# EasyEDA Pro project EasyEDApro.epro, board EnergyMeter
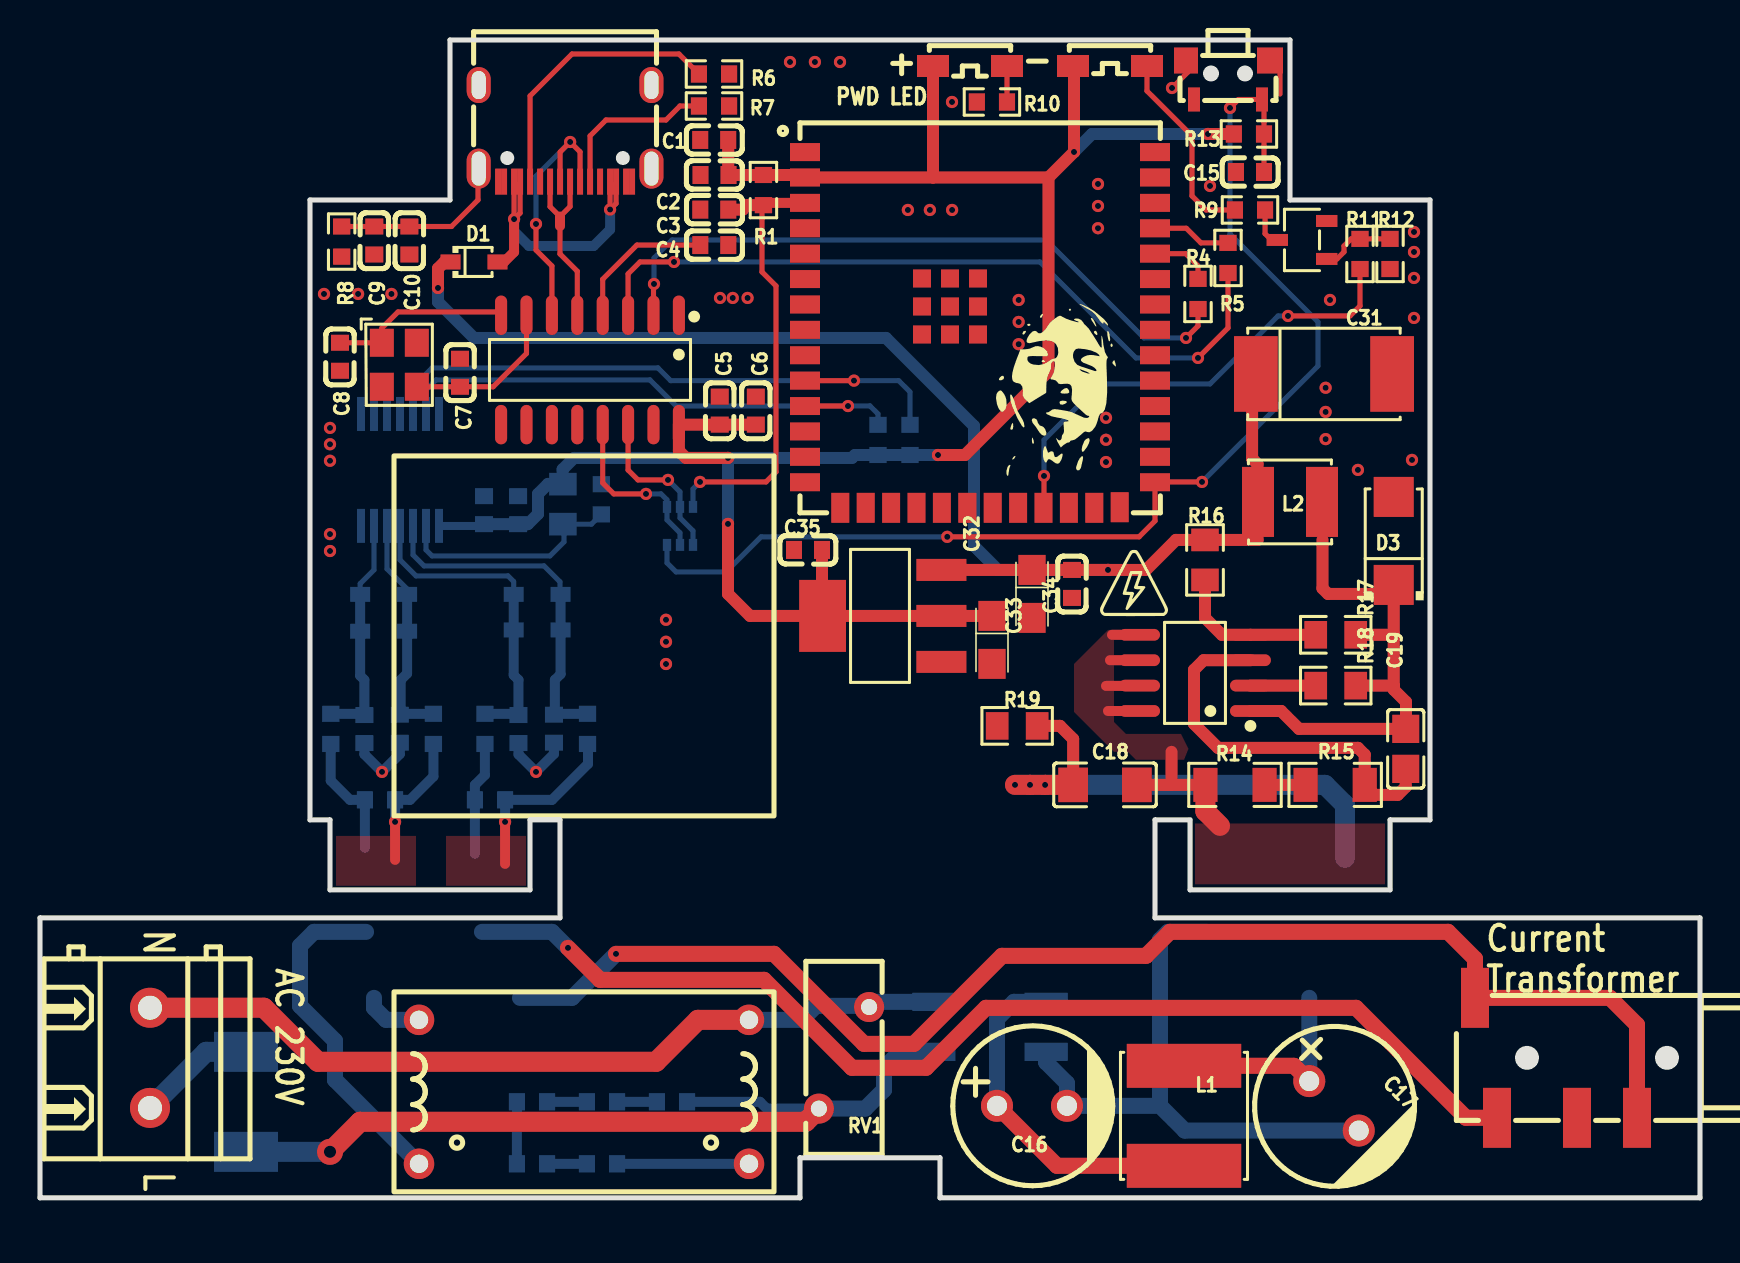
[diagram p1: board, top side]
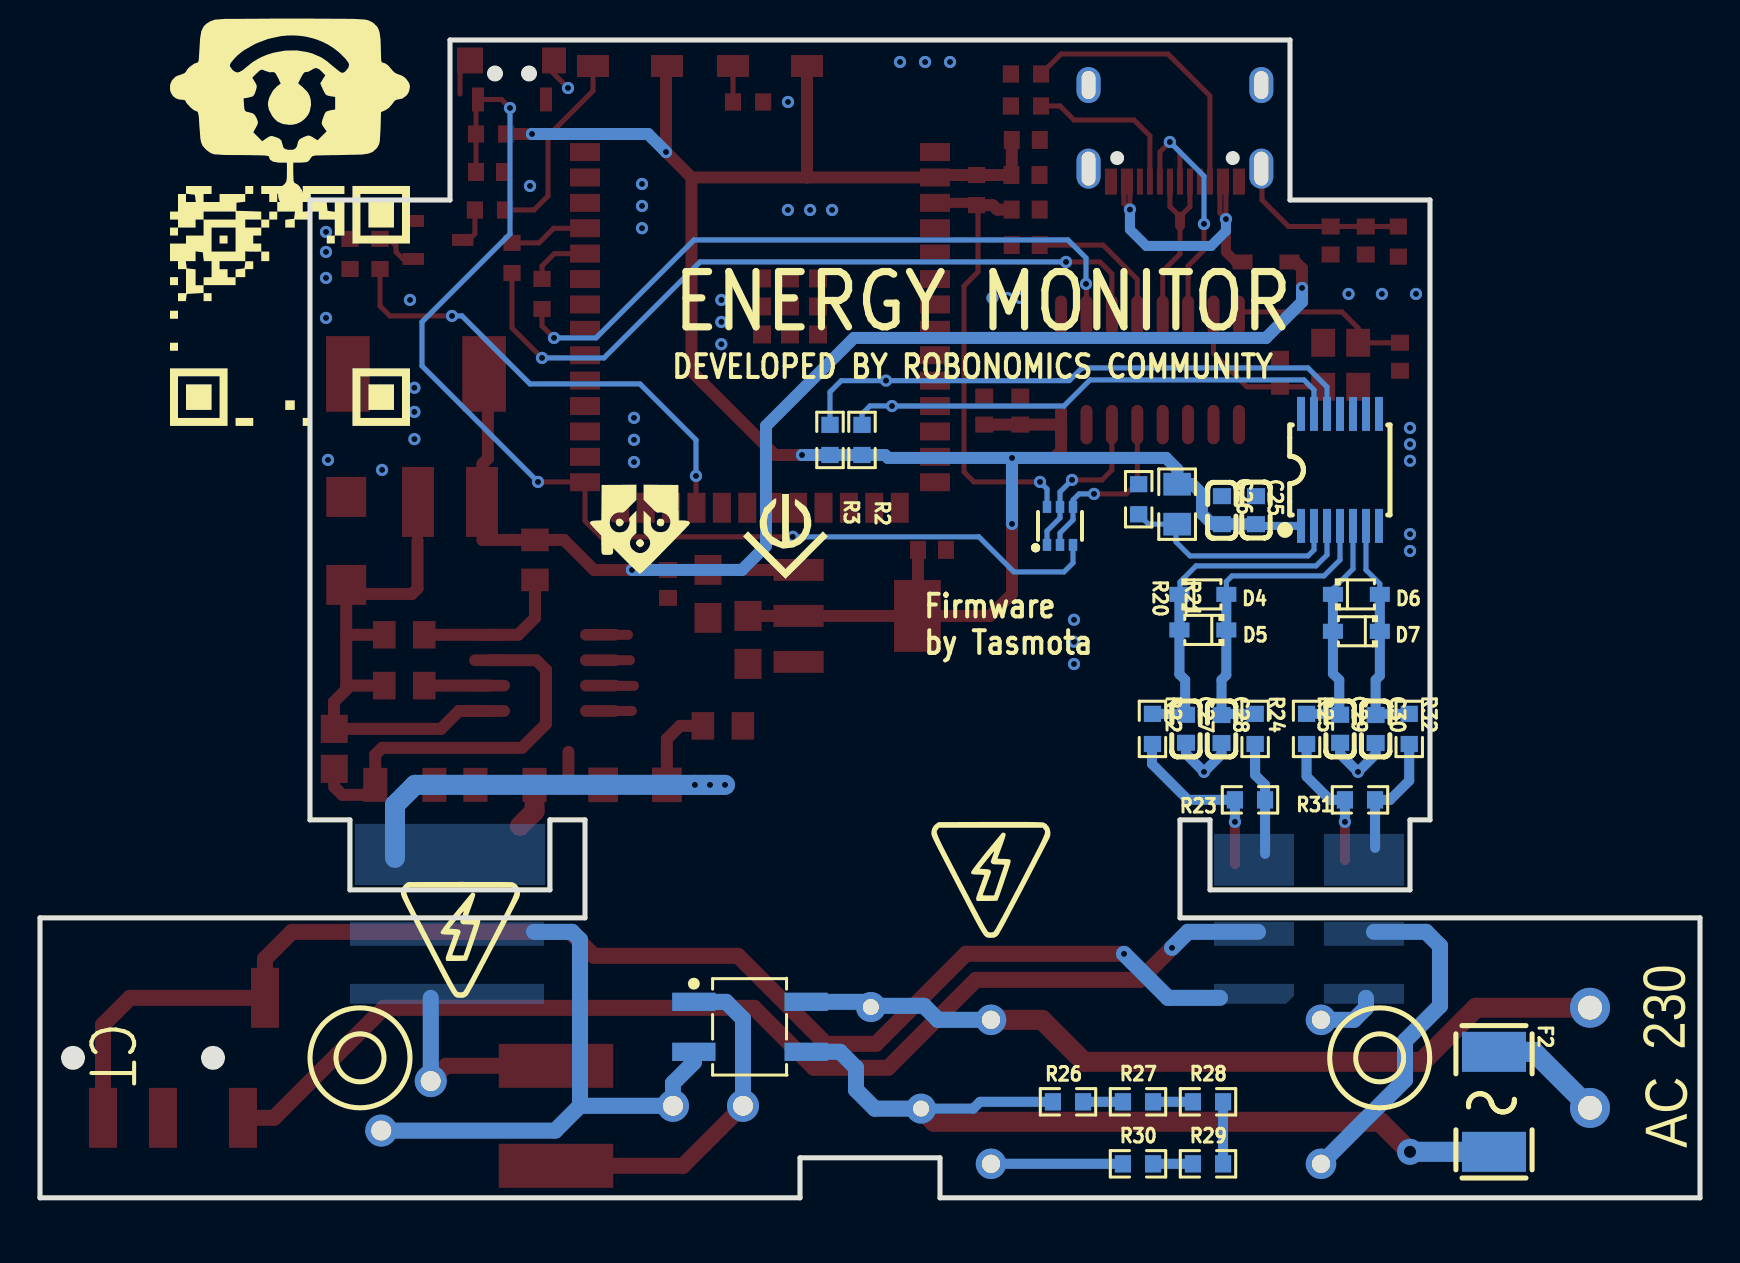
[diagram p2: board, bottom side, seen from below]

Outline 83 x 57.9 mm; copper layers: Top Layer, Bottom Layer. Coordinates in mm from the lower left corner of the outline.
Outline path: 0,14 26,14 26,18.9 24.5,18.9 24.5,15.4 14.5,15.4 14.5,18.9 13.5,18.9 13.5,49.9 20.5,49.9 20.5,57.9 62.5,57.9 62.5,49.9 69.5,49.9 69.5,18.9 67.5,18.9 67.5,15.4 57.5,15.4 57.5,18.9 55.75,18.9 55.75,14 83,14 83,0 45,0 45,2 38,2 38,0 0,0 0,14
Stack: Top Layer 0.035mm / Dielectric1 1.51mm FR4 er 4.5 / Bottom Layer 0.035mm

## Design rules (mm)
template: JLCPCB Capability(Two Layers Board)
spacing copperThickness1oz (default): track to track 0.102, other pairs 0.152 to 0.3
spacing copperThickness2oz: track to track 0.203, other pairs 0.152 to 0.3
track width copperThickness1oz (default): min 0.127, default 0.254, max 2.54
track width copperThickness2oz: min 0.203, default 0.254, max 2.54
differential pair differentialPair (default): width min 0.127, default 0.254, max 2.54; gap min 0.152, default 0.152
via viaSize (default): diameter min 0.5, default 0.61, max 10; hole min 0.3, default 0.305, max 6.3

## Placement (name value [footprint] x y rotation side)
C1  100nF  [C0603]  33.71 52.9 180 top
C2  10uF  [c0603]  33.73 51.15 0 top
C3  100nF  [C0603]  33.72 49.42 180 top
C4  100nF  [C0603]  33.72 47.65 180 top
C5  100nF  [C0603]  33.99 39.36 90 top
C6  10nF  [C0603]  35.79 39.36 90 top
C7  22pF  [C0603]  21 41.26 270 top
C8  22pF  [C0603]  15 42.06 90 top
C9  100nF  [C0603]  16.72 47.87 90 top
C10  1nF  [C0603]  18.47 47.87 90 top
C15  100nF  [C0603]  60.5 51.3 180 top
C16  3.3uF  [CAP-TH_BD8.0-P3.50-D0.6-FD]  49.6 4.6 0 top
C17  3.3uF  [CAP-TH_BD8.0-P3.50-D0.6-FD]  64.7 4.6 315 top
C18  10nF  [C1206]  53.25 20.65 0 top
C19  2.2uF  [C0805]  68.29 22.45 270 top
C25  10uF  [C0603]  22.2 34.39 270 bottom
C26  100nF  [C0603]  23.9 34.39 90 bottom
C27  33nF  [C0603]  25.7 23.46 90 bottom
C28  33nF  [C0603]  23.92 23.44 270 bottom
C29  33nF  [C0603]  17.99 23.46 90 bottom
C30  33nF  [C0603]  16.22 23.44 270 bottom
C31  680uF  [CAP-SMD_L7.3-W4.3]  64.2 41.2 180 top
C32  22uF  [CASE-A_3216]  47.6 27.9 270 top
C33  22uF  [CASE-A_3216]  49.6 30.2 270 top
C34  100nF  [C0603]  51.6 30.7 90 top
C35  100nF  [C0603]  38.4 32.4 0 top
CN1  PJ-320D  [AUDIO-SMD_PJ-320D]  75.8 7 270 top
D1  -  [SOD-323_L1.8-W1.3-LS2.5-RD]  21.7 46.8 0 top
D2  MB10F  [MBF_L4.8-W3.9-P2.50-LS6.7-BL]  47.5 8.55 270 bottom
D3  ES1J  [SMA_L4.3-W2.6-LS5.2-RD]  67.69 32.85 90 top
D4  1N4148WS  [SOD-323_L1.8-W1.3-LS2.5-RD]  24.86 30.18 180 bottom
D5  1N4148WS  [SOD-323_L1.8-W1.3-LS2.5-RD]  24.86 28.4 0 bottom
D6  1N4148WS  [SOD-323_L1.8-W1.3-LS2.5-RD]  17.18 30.18 180 bottom
D7  1N4148WS  [SOD-323_L1.8-W1.3-LS2.5-RD]  17.18 28.33 0 bottom
F2  JFC2410-1200FS  [F2410]  10.3 4.8 270 bottom
L1  680uH  [IND-SMD_L6.0-W6.0]  57.2 4.1 90 top
L2  470uH  [IND-SMD_L4.0-W4.0]  62.5 34.8 180 top
L3  HPT225A-G  [XFMR-TH_4P-L19.0-10.0-P7.20]  27.2 5.3 180 top
LED2  XL-4008UGC  [LED-SMD_L4.0-W1.4-RD_GREEN]  53.5 56.6 180 top
P1  WJ128V-5.0-2P  [CONN-TH_2P-P5.00_WJ128V-5.0-2P]  5.5 7 270 top
Q1  -  [SC-70-6_L2.2-W1.3-P0.65-LS2.1-BR]  32 33.6 270 bottom
Q2  SS8050  [SOT-23-3_L2.9-W1.6-P1.90-LS2.8-BR]  63.1 47.9 0 top
R1  10kΩ  [R0603]  36.17 50.4 270 top
R2  4.7kΩ  [R0603]  41.9 37.9 90 bottom
R3  4.7kΩ  [R0603]  43.5 37.9 90 bottom
R4  470  [R0603]  57.9 45.2 270 top
R5  470  [R0603]  59.4 47 270 top
R6  5.1kΩ  [R0603]  33.7 56.2 180 top
R7  5.1kΩ  [R0603]  33.7 54.6 180 top
R8  1MΩ  [R0603]  15.08 47.82 90 top
R9  1kΩ  [R0603]  60.5 49.4 180 top
R10  1kΩ  [R0603]  47.6 54.8 0 top
R11  1kΩ  [R0603]  66 47.2 90 top
R12  10kΩ  [R0603]  67.5 47.2 270 top
R13  10kΩ  [R0603]  60.45 53.2 0 top
R14  1.5MΩ  [R1206]  59.75 20.65 0 top
R15  1.5MΩ  [R1206]  64.76 20.65 0 top
R16  36kΩ  [R0805]  58.25 31.9 270 top
R17  10kΩ  [R0805]  64.79 28.16 180 top
R18  820mΩ  [R0805]  64.79 25.62 180 top
R19  0Ω  [R0805]  48.86 23.6 0 top
R20  10kΩ  [R0603]  28.07 34.93 90 bottom
R21  SDNT2012X103F3950FTF  [R0805]  26.14 34.69 90 bottom
R22  1kΩ  [R0603]  27.38 23.45 90 bottom
R23  1Ω  [R0603]  22.5 19.9 0 bottom
R24  1kΩ  [R0603]  22.24 23.45 90 bottom
R25  1kΩ  [R0603]  19.67 23.45 90 bottom
R26  20kΩ  [R0603]  31.6 4.8 180 bottom
R27  20kΩ  [R0603]  28.1 4.8 180 bottom
R28  20kΩ  [R0603]  24.6 4.8 180 bottom
R29  20kΩ  [R0603]  24.6 1.7 0 bottom
R30  20kΩ  [R0603]  28.1 1.7 0 bottom
R31  22Ω  [R0603]  17 19.9 0 bottom
R32  1kΩ  [R0603]  14.54 23.45 90 bottom
RV1  RM07D471KC14E100  [RES-TH_L9.5-W3.8-P5.08-D0.6-S2.5]  40.2 7 270 top
SW2  TS-1010-C-A  [key-smd_tx-1010-x-x]  59.4 55.9 0 top
U1  ESP32-S3-WROOM-1U-N16  [wirelm-smd_esp32-s3-wroom-1u]  47 43.4 0 top
U4  -  [SOIC-16_L9.9-W3.9-P1.27-LS6.0-BL]  27.5 41.4 180 top
U7  SY50282FAC  [SOIC-8_L4.9-W3.9-P1.27-LS6.0-BL]  57.75 26.25 90 top
U9  BL0940  [TSSOP-14_L5.0-W4.4-P0.65-LS6.4-BL]  18 36.4 180 bottom
U10  XL-4008SURC  [LED-SMD_L4.0-W1.4-FD_C9900036310]  46.5 56.6 0 top
U11  AMS1117-3.3  [SOT-223-3_L6.5-W3.4-P2.30-LS7.0-BR]  42.1 29.1 0 top
USB1  KH-TYPE-C-16P  [USB-C-SMD_KH-TYPE-C-16P]  26.25 53.23 180 top
X1  12MHz  [OSC-SMD_4P-L3.2-W2.5-BL]  17.97 41.66 270 top

## Footprints (pads in the part's own frame, mm; a bottom-side part is the same pattern mirrored in y, then rotated)
AUDIO-SMD_PJ-320D
  rect 3x1.4 smd: 1(-3,-4.05) 2(3,4.05) 3(3,1.05) 4(3,-2.95)
C0603
  rect 0.8x0.9 smd: 1(-0.7,0) 2(0.7,0)
c0603
  rect 0.8x0.899 smd: 1(-0.701,0) 2(0.701,0)
C0805
  rect 1.41x1.35 smd: 1(-1,0) 2(1,0)
C1206
  rect 1.485x1.728 smd: 1(-1.593,0) 2(1.593,0)
CAP-SMD_L7.3-W4.3
  rect 2.185x3.78 smd: 1(3.406,0) 2(-3.406,0)
CAP-TH_BD8.0-P3.50-D0.6-FD
  round 1.6 hole 1: 1(-1.75,0) 2(1.75,0)
CASE-A_3216
  rect 1.5x1.359 smd: 1(-1.2,0) 2(1.2,0)
CONN-TH_2P-P5.00_WJ128V-5.0-2P
  round 2 hole 1.2: 1(-2.505,0) 2(2.505,0)
F2410
  rect 2x3.2 smd: 1(-2.5,0) 2(2.5,0)
IND-SMD_L4.0-W4.0
  rect 1.6x3.5 smd: 1(-1.6,0) 2(1.6,0)
IND-SMD_L6.0-W6.0
  rect 2.2x5.72 smd: 1(-2.5,0) 2(2.5,0)
key-smd_tx-1010-x-x
  rect 0.6x1.2 smd: 1(-1.7,-0.975) 2(1.7,-0.975)
  rect 1.2x1.3 smd: 3(-2.1,0.975)
  rect 1.3x1.3 smd: 4(2.1,0.975)
LED-SMD_L4.0-W1.4-FD_C9900036310
  rect 1.6x1.1 smd: 1(-1.85,0) 2(1.85,0)
LED-SMD_L4.0-W1.4-RD_GREEN
  rect 1.6x1.1 smd: 1(-1.85,0) 2(1.85,0)
MBF_L4.8-W3.9-P2.50-LS6.7-BL
  rect 0.91x2.165 smd: 1(1.25,2.808) 2(-1.25,2.808) 3(-1.25,-2.808) 4(1.25,-2.808)
OSC-SMD_4P-L3.2-W2.5-BL
  rect 1.4x1.2 smd: 1(-1.1,-0.875) 2(1.1,-0.875) 3(1.1,0.875) 4(-1.1,0.875)
R0603
  rect 0.806x0.864 smd: 1(-0.753,0) 2(0.753,0)
R0805
  rect 1.133x1.377 smd: 1(-1,0) 2(1,0)
R1206
  rect 1.208x1.701 smd: 1(-1.479,0) 2(1.479,0)
RES-TH_L9.5-W3.8-P5.08-D0.6-S2.5
  round 1.5 hole 0.8: 1(-2.54,1.255) 2(2.54,-1.255)
SC-70-6_L2.2-W1.3-P0.65-LS2.1-BR
  rect 0.6x0.42 smd: 1(0.95,-0.65) 2(0.95,0) 3(0.95,0.65) 4(-0.95,0.65) 5(-0.95,0) 6(-0.95,-0.65)
SMA_L4.3-W2.6-LS5.2-RD
  rect 2x2 smd: 1(-2.2,0) 2(2.2,0)
SOD-323_L1.8-W1.3-LS2.5-RD
  rect 1x0.75 smd: 1(-1.173,0) 2(1.173,0)
SOIC-8_L4.9-W3.9-P1.27-LS6.0-BL
  oval 0.588x2.045 smd: 1(-1.905,-2.772) 2(-0.635,-2.772) 3(0.635,-2.772) 4(1.905,-2.772) 5(1.905,2.772) 6(0.635,2.772) 7(-0.635,2.772) 8(-1.905,2.772)
SOIC-16_L9.9-W3.9-P1.27-LS6.0-BL
  oval 0.602x1.971 smd: 1(-4.445,-2.736) 2(-3.175,-2.736) 3(-1.905,-2.736) 4(-0.635,-2.736) 5(0.635,-2.736) 6(1.905,-2.736) 7(3.175,-2.736) 8(4.445,-2.736) 9(4.445,2.736) 10(3.175,2.736) 11(1.905,2.736) 12(0.635,2.736) 13(-0.635,2.736) 14(-1.905,2.736) 15(-3.175,2.736) 16(-4.445,2.736)
SOT-23-3_L2.9-W1.6-P1.90-LS2.8-BR
  rect 1.07x0.6 smd: 1(1.235,-0.95) 2(1.235,0.95) 3(-1.235,0)
SOT-223-3_L6.5-W3.4-P2.30-LS7.0-BR
  rect 2.5x1.1 smd: 1(2.97,-2.3) 2(2.97,0) 3(2.97,2.3)
  rect 2.34x3.6 smd: 4(-2.97,0)
TSSOP-14_L5.0-W4.4-P0.65-LS6.4-BL
  rect 0.4x1.7 smd: 1(-1.95,-2.8) 2(-1.3,-2.8) 3(-0.65,-2.8) 4(0,-2.8) 5(0.65,-2.8) 6(1.3,-2.8) 7(1.95,-2.8) 8(1.95,2.8) 9(1.3,2.8) 10(0.65,2.8) 11(0,2.8) 12(-0.65,2.8) 13(-1.3,2.8) 14(-1.95,2.8)
USB-C-SMD_KH-TYPE-C-16P
  oval 1.2x2 hole 0.7x1.7: 1(-4.32,1.765) 2(4.32,1.765)
  oval 1.2x1.8 hole 0.7x1.4: 3(-4.32,-2.415) 4(4.32,-2.415)
  rect 0.3x1.3 smd: A1(-3.35,2.415) A4(-2.55,2.415) A5(-1.25,2.415) A6(-0.25,2.415) A7(0.25,2.415) A8(1.25,2.415) A9(2.55,2.415) A12(3.35,2.415) B1(3.05,2.415) B4(2.25,2.415) B5(1.75,2.415) B6(0.75,2.415) B7(-0.75,2.415) B8(-1.75,2.415) B9(-2.25,2.415) B12(-3.05,2.415)
wirelm-smd_esp32-s3-wroom-1u
  rect 1.5x0.9 smd: 1(-8.75,8.895) 2(-8.75,7.625) 3(-8.75,6.355) 4(-8.75,5.085) 5(-8.75,3.815) 6(-8.75,2.545) 7(-8.75,1.275) 8(-8.75,0.005) 9(-8.75,-1.265) 10(-8.75,-2.535) 11(-8.75,-3.805) 12(-8.75,-5.075) 13(-8.75,-6.345) 14(-8.75,-7.615) 27(8.75,-7.615) 28(8.75,-6.345) 29(8.75,-5.075) 30(8.75,-3.805) 31(8.75,-2.535) 32(8.75,-1.265) 33(8.75,0.005) 34(8.75,1.275) 35(8.75,2.545) 36(8.75,3.815) 37(8.75,5.085) 38(8.75,6.355) 39(8.75,7.625) 40(8.75,8.895)
  rect 0.9x1.5 smd: 15(-6.985,-8.895) 16(-5.715,-8.895) 17(-4.445,-8.895) 18(-3.175,-8.895) 19(-1.905,-8.895) 20(-0.635,-8.895) 21(0.635,-8.895) 22(1.905,-8.895) 23(3.175,-8.895) 24(4.445,-8.895) 25(5.715,-8.895) 26(6.985,-8.865)
  rect 0.9x0.9 smd: 41(-2.9,2.575) 41(-2.9,1.175) 41(-2.9,-0.225) 41(-1.5,2.575) 41(-1.5,1.175) 41(-1.5,-0.225) 41(-0.1,2.575) 41(-0.1,1.175) 41(-0.1,-0.225)
XFMR-TH_4P-L19.0-10.0-P7.20
  round 1.524 hole 0.914: 1(-8.25,3.6) 2(-8.25,-3.6) 3(8.25,3.6) 4(8.25,-3.6)

## Nets
As in the schematic, except:
L: D2.1 F2.2 R26.1 RV1.2
N_IN: D2.2 L3.2 P1.1 RV1.1

Pads without a net: CN1 3; U1 4 5 6 7 8 9 12 13 14 15 16 17 18 19 20 21 22 24 25 26 28 29 30 31 32 33 34 35 38 39 40; U4 9 10 11 12 15; U9 11 14; USB1 A8 B8

## Via types
v1: diameter 0.61, hole 0.305, Top Layer to Bottom Layer, 76 vias
v2: diameter 1.3, hole 0.61, Top Layer to Bottom Layer, 1 via

## Routing (per net, layer and track width the routed paths; a pad name or vN(x,y) marks a point on that pad's centre or on a via; arc(x,y) is an arc through that point)
+5V: length 69.8
  Top Layer w0.6: v1(19.9,45.5) 19.9,46.47 20.23,46.8 D1.1 ; 60.6,41.2 60.6,36.97 60.88,36.7 60.88,32.9 R16.1 56.8,32.9 55.3,31.4 v1(53.4,31.4) C34.2 C33.1 U11.3
  Bottom Layer w0.6: v1(19.9,45.5) 19.9,44.8 21.7,43 42.3,43 46.7,38.6 46.7,32.6 47.9,31.4 v1(53.4,31.4)
GND: length 10.8
  Top Layer w0.254: v1(56.6,55.5) 57.4,56.3 57.4,56.88 ; 62,55.2 62,56.48 61.6,56.88
  Bottom Layer w0.5: C29.1 17.99,22.19 v1(17.1,21.3) 16.22,22.18 C30.2 ; C27.1 25.7,22.2 v1(24.8,21.3) 23.92,22.18 C28.2
  vias: v1(14.2,45.2) v1(14.5,38.5) v1(14.5,37.68) v1(14.5,36.86) v1(14.5,33.19) v1(14.5,32.35) v1(15.91,45.2) v1(17.57,45.2) v1(31.3,28.91) v1(31.3,27.81) v1(31.3,26.69) v1(34,45) v1(34.64,45) v1(35.38,45) v1(37.5,56.8) v1(38.75,56.8) v1(40,56.8) v1(43.39,49.4) v1(44.49,49.4) v1(45.6,54.8) v1(45.61,49.4) v1(48.93,44.9) v1(48.93,43.8) v1(48.93,42.69) v1(52.9,50.7) v1(52.9,49.6) v1(52.9,48.49) v1(53.3,39.01) v1(53.3,37.91) v1(53.3,36.79) v1(58.5,50.6) v1(64.28,40.51) v1(64.28,39.3) v1(64.28,37.94) v1(64.5,44.9) v1(65.9,36.4) v1(68.6,36.9) v1(68.7,48.3) v1(68.7,47.3) v1(68.7,46) v1(68.7,44)
GNDS: length 25.6
  Top Layer w0.6: 64.12,32.9 64.12,30.48 64.4,30.2 67.58,30.2 67.69,30.31 ; 67.69,28.18 67.66,28.16 R17.1 ; 67.69,28.18 67.69,30.31 ; 67.69,28.18 67.69,25.61 ; 67.69,30.31 D3.1 ; 67.69,25.61 67.69,25.41 68.3,24.8 68.3,23.46 C19.1 62.95,23.45 62.06,24.34 U7.1 ; 67.69,25.61 67.68,25.62 R18.1
PGND: length 55.8
  Top Layer w0.6: R19.2 51,23.6 51.66,22.94 C18.1
  Top Layer w1: v1(48.75,20.65) v1(49.5,20.65) v1(50.25,20.65) C18.1
  Bottom Layer w0.8: D2.4 50.31,6.77 51.35,5.73 C16.2 56,4.6 ; C17.2 57.24,3.36 56,4.6 ; 56,4.6 56,12.9 56.4,13.3 58.3,13.3
  Bottom Layer w1: v1(48.75,20.65) v1(49.5,20.65) v1(50.25,20.65) 64.25,20.65 65.25,19.65 65.25,17
VDD3V3: length 113.4
  Top Layer w0.6: U11.4 39.1,29.13 C35.2 ; U11.4 35.5,29.1 34.4,30.2 v1(34.4,33.7) ; U11.4 U11.2 C32.1 ; 59.69,53.2 v1(58.4,53.2) ; 44.65,51.03 U1.2 38.13,51.15 R1.1 C2.2 34.41,51.17 C1.1 ; 44.65,51.03 44.65,51.03 44.65,56.4 ; 44.65,51.03 50.43,51.03 ; 50.43,51.03 50.43,41.33 46.25,37.15 v1(44.9,37.15) ; 50.43,51.03 v1(51.7,52.3) 51.7,56.35 51.65,56.4 ; C6.1 C5.1 U4.16 31.94,37.36 32.3,37 v1(34.4,37)
  Bottom Layer w0.4: 22.2,33.69 22.11,33.6 U9.1
  Bottom Layer w0.6: 26.13,35.7 R21.2 ; 26.13,35.7 26.13,36.43 26.7,37 v1(34.4,37) ; 26.13,35.7 25.4,35.7 24.9,35.2 24.9,34.2 24.39,33.69 22.2,33.69 ; v1(34.4,37) 40.6,37 40.75,37.15 R2.1 R3.1 v1(44.9,37.15) ; v1(34.4,37) v1(34.4,33.7) ; v1(58.4,53.2) 52.6,53.2 v1(51.7,52.3)
BUTTON: length 59.3
  Top Layer w0.254: v1(58.1,35.8) 55.76,35.8 U1.27 55.75,33.85 54.95,33.05 v1(45.36,33.05) ; v1(59.5,54.5) 59.93,54.93 61.2,54.93 R13.2 C15.1
  Bottom Layer w0.254: v1(45.36,33.05) 36.05,33.05 34.3,31.3 31.8,31.3 31.35,31.75 Q1.3 ; v1(58.1,35.8) 63.9,41.6 63.9,43.8 59.5,48.2 v1(59.5,54.5)
CC1: length 14
  Top Layer w0.254: USB1.B5 24.5,55.1 26.6,57.2 31.95,57.2 R6.2
CC2: length 8.3
  Top Layer w0.254: R7.2 32,54.6 31.3,53.9 28.3,53.9 27.5,53.1 USB1.A5
DTR: length 9
  Top Layer w0.254: v1(30.3,35.2) 28.69,35.2 28.13,35.75 U4.13
  Bottom Layer w0.254: Q1.2 32,33.25 31.35,33.9 Q1.4 31.35,34.9 31.05,35.2 v1(30.3,35.2)
ESP_EN: length 22.9
  Top Layer w0.254: 36.1,49.57 36.1,46.3 36.8,45.6 36.8,36.3 36.3,35.8 v1(33,35.8)
  Top Layer w0.5: U1.3 36.29,49.76 R1.2
  Top Layer w0.6: R1.2 35.36,49.64 35.14,49.42 C3.1
  Bottom Layer w0.254: Q1.6 32.65,35.45 v1(33,35.8)
ESP_RX0: length 3.1
  Top Layer w0.254: U1.36 57.28,47.22 57.9,46.6 R4.1
ESP_TX0: length 4
  Top Layer w0.254: R5.1 58.05,47.75 57.31,48.48 U1.37
GPIO_LED_SATUS: length 23.8
  Top Layer w0.254: R11.1 66,44.6 65.5,44.1 v1(62.4,44.1) ; v1(50.2,36.1) 50.2,34.53 U1.23
  Bottom Layer w0.254: v1(62.4,44.1) 61.9,44.1 58.5,40.7 53,40.7 50.2,37.9 v1(50.2,36.1)
IN1: length 62.8
  Top Layer w0.8: v1(26.4,12.5) 28,10.9 36.2,10.9 40.6,6.5 44.3,6.5 47.3,9.5 65.8,9.5 71.3,4 CN1.4
  Bottom Layer w0.5: 21.75,17.2 R23.1 21.75,20.65 22.24,21.14 R24.1
  Bottom Layer w0.8: 22.1,13.3 25.6,13.3 v1(26.4,12.5)
IP1: length 77.8
  Top Layer w0.5: v1(23.25,18.8) 23.25,16.7
  Top Layer w0.8: v1(28.8,12.2) 36.7,12.2 41.2,7.7 43.7,7.7 48.1,12.1 55.3,12.1 56.5,13.3 70.4,13.3 71.75,11.95 CN1.1 78.5,10 79.85,8.65 CN1.2
  Bottom Layer w0.5: v1(23.25,18.8) R23.2 25.6,19.9 27.4,21.7 27.4,22.67 R22.1
  Bottom Layer w0.8: v1(28.8,12.2) 26.6,10 24,10
L: length 43.8
  Top Layer w1: v2(14.5,2.3) 16,3.8 38.28,3.8 RV1.2
  Bottom Layer w0.5: RV1.2 36.34,4.46 36,4.8 R26.1
  Bottom Layer w0.8: D2.1 43,7.3 42.2,6.5 42.2,5.4 41.26,4.46 RV1.2
  Bottom Layer w1: v2(14.5,2.3) F2.2
L_IN: length 6
  Bottom Layer w1: F2.1 8.3,7.3 P1.2
LX: length 24.3
  Top Layer w0.5: U7.8 53.4,24.34 ; U7.5 53.6,28.16 ; U7.6 53.5,26.89 ; 54.98,25.62 54.96,25.6 53.3,25.6
  Top Layer w0.6: 56.58,20.65 C18.2 ; 56.58,20.65 56.58,22.3 ; 56.58,20.65 R14.1
  Top Layer w0.8: L1.2 62.7,6.6 C17.1
  Top Layer w1: R14.1 58.27,19.33 59,18.6
  Bottom Layer w0.8: C17.1 63.46,10
N_IN: length 41.6
  Top Layer w1: P1.1 11.2,9.5 13.9,6.8 30.8,6.8 32.9,8.9 L3.2
  Bottom Layer w0.8: L3.2 38.1,8.9 38.8,9.6 41.4,9.6 41.46,9.54 41.72,9.8 D2.2
PM_RX: length 31.2
  Top Layer w0.254: U1.10 v1(40.7,40.87)
  Bottom Layer w0.254: R3.2 43.5,40.3 42.94,40.87 v1(40.7,40.87) 31.53,40.87 30.9,41.5 19.6,41.5 18.65,40.55 U9.12
PM_TX: length 27.4
  Top Layer w0.254: U1.11 v1(40.4,39.59)
  Bottom Layer w0.254: U9.13 19.3,40.4 19.8,40.9 30.5,40.9 31.81,39.59 v1(40.4,39.59) 40.4,39.6 41.5,39.6 41.9,39.2 R2.2
RTS: length 8.2
  Top Layer w0.254: U4.14 29.41,36.4 29.9,35.9 v1(31.4,35.9)
  Bottom Layer w0.254: Q1.1 32.65,33.35 32,34 Q1.5 32,35.3 v1(31.4,35.9)
SHIELD: length 8.9
  Top Layer w0.254: USB1.2 21.9,51.43 21.9,49.9 20.57,48.57 C10.2 C9.2 15.08,48.57
USBDN: length 14.1
  Top Layer w0.254: U4.6 25.59,46.6 24.8,47.4 v1(24.8,48.7) ; USB1.B7 27,52.3 v1(26.51,52.8) 26,52.3 USB1.A7
  Bottom Layer w0.254: v1(24.8,48.7) 24.8,51.09 v1(26.51,52.8)
USBDP: length 9.2
  Top Layer w0.254: U4.5 26.87,46.34 26,47.2 26,48.6 ; USB1.A6 26.5,49.57 26,49.07 25.5,49.56 USB1.B6
  Top Layer w0.5: 26,48.6 26,49.07
VN: length 23.3
  Bottom Layer w0.5: 16.25,17.5 R31.1 15.5,19.9 14.54,20.86 R32.1
  Bottom Layer w0.8: L3.3 14.75,5.9 14.75,7.85 13,9.6 13,12.6 13.7,13.3 16.3,13.3
VP: length 10
  Top Layer w0.5: v1(17.75,18.8) 17.75,16.9
  Bottom Layer w0.5: v1(17.75,18.8) R31.2 18.5,19.9 19.67,21.07 R25.1
  Bottom Layer w0.8: 16.7,10 16.7,9.5 17.3,8.9 L3.4
VUSB: length 16.5
  Top Layer w0.254: USB1.A9 v1(23.7,48.94) 24,49.24 USB1.B4 ; USB1.B9 v1(28.5,49.42) 28.8,49.72 USB1.A4
  Top Layer w0.5: v1(23.7,48.94) 23.7,47.3 23.2,46.8 D1.2
  Bottom Layer w0.5: v1(23.7,48.94) 23.7,48.34 24.45,47.6 27.68,47.6 28.5,48.42 v1(28.5,49.42)
X0: length 9.2
  Top Layer w0.254: C8.2 X1.1 17.09,43.49 17.9,44.3 22.89,44.3 U4.8
X1: length 8.1
  Top Layer w0.254: X1.3 C7.2 22.66,40.56 24.32,42.23 U4.7
$1N2408: length 11.6
  Bottom Layer w0.254: R20.1 27.57,33.69 R21.1 26.2,33.63 26.2,32.8 25.5,32.1 19.6,32.1 19.3,32.4 U9.2
$1N2433: length 2.1
  Top Layer w0.6: R14.2 R15.1
$1N2434: length 3.3
  Top Layer w0.6: R18.2 60.52,25.62
$1N2435: length 19.7
  Top Layer w0.6: C19.2 68.29,20.55 67.89,20.15 66.74,20.15 66.24,20.65 66.24,22.16 65.9,22.5 58.9,22.5 57.7,23.7 57.7,26.4 58.19,26.89 U7.3
$1N2436: length 7.8
  Top Layer w0.6: R17.2 U7.4 59.09,28.16 58.25,29 R16.2
$1N6043: length 1.9
  Top Layer w0.254: R9.1 61.25,48.21 61.56,47.9 Q2.3
$1N6046: length 3.8
  Top Layer w0.254: Q2.1 64.85,46.95 65.2,47.3 65.2,47.6 65.55,47.95 R11.2 R12.1
$1N6113: length 7.4
  Top Layer w0.254: C4.2 29.85,47.65 28.13,45.94 U4.4
$1N6115: length 37.7
  Top Layer w0.254: v1(57.9,42) 59.4,43.5 R5.2 ; U4.3 29.41,46.21 30,46.8 v1(31.7,46.8)
  Bottom Layer w0.254: v1(57.9,42) 54.8,42 50,46.8 v1(31.7,46.8)
$1N6116: length 33.6
  Top Layer w0.254: v1(57.3,43) 57.9,43.6 R4.2 ; v1(30.7,45.7) 30.68,45.68 U4.2
  Bottom Layer w0.254: v1(57.3,43) 55.2,43 50.3,47.9 31.6,47.9 30.7,47 v1(30.7,45.7)
$1N10199: length 2
  Bottom Layer w0.5: R30.1 R29.2
$1N10201: length 3.1
  Bottom Layer w0.5: R29.1 R28.2
$1N10203: length 2
  Bottom Layer w0.5: R28.1 R27.2
$1N10205: length 2
  Bottom Layer w0.5: R27.1 R26.2
$1N11192: length 17.8
  Bottom Layer w0.254: D4.1 26,30.21 26,30.8 25.2,31.6 19.2,31.6 18.65,32.15 U9.3 ; C27.2 25.74,24.2
  Bottom Layer w0.5: R22.2 25.74,24.2 25.74,25.9 26.03,26.19 D5.2 D4.1
$1N11195: length 16.3
  Bottom Layer w0.254: U9.4 18,31.9 18.8,31.1 23.4,31.1 23.68,30.82 D4.2
  Bottom Layer w0.5: R24.2 23.86,24.2 C28.1 23.92,25.9 23.68,26.14 D5.1 D4.2
$1N11200: length 11.6
  Bottom Layer w0.254: U9.5 17.35,31.45 18.35,30.45 18.35,29.96 ; C29.2 18.04,24.2
  Bottom Layer w0.5: 18.35,29.96 D7.2 18.35,26.22 18.04,25.9 18.04,24.2 R25.2
$1N11209: length 11.5
  Bottom Layer w0.254: U9.6 16.7,31.4 16.01,30.71 16.01,29.96
  Bottom Layer w0.5: 16.01,29.96 D7.1 16.01,26.11 16.22,25.9 C30.1 16.16,24.2 R32.2
$1N11609: length 17.8
  Top Layer w0.8: C16.1 50.85,1.6 L1.1
  Bottom Layer w0.8: C16.1 47.85,8.95 48.7,9.8 D2.3
$1N21646: length 9.9
  Top Layer w0.254: LED2.1 55.35,55.35 57.6,53.1 57.6,50.1 58.3,49.4 R9.2
$1N25048: length 1.8
  Top Layer w0.254: R10.2 U10.2
$1N34811: length 6.6
  Bottom Layer w0.5: L3.1 R30.2

## Copper pours and planes (outline as drawn; the poured copper is in the pictures)
GND on Top Layer: 13.5,49.4 13.5,47.03 9.13,47.03 8.9,46.8 8.9,44 13.5,44 13.5,20.05 37.5,20.05 37.5,25.2 45.4,25.2 45.4,21.6 48.7,21.6 48.7,24.3 58,33.6 69.11,33.6 69.11,49.7 62.3,49.7 62.3,57.78 20.5,57.78 20.5,49.4
GND on Bottom Layer: 20.5,57.9 20.5,49.9 13.5,49.9 13.5,44.18 8.9,44.18 8.9,42.4 8.8,42.3 13.5,42.3 13.5,25.4 45.4,25.4 45.4,22.1 69.5,22.1 69.5,49.9 62.5,49.9 62.5,57.9
PGND on Bottom Layer: 57.75,18.7 67.25,18.7 67.25,15.65 57.75,15.65
PGND on Bottom Layer: 57.8,13.8 67.5,13.8 67.5,12.6 57.8,12.6
IN1 on Bottom Layer: 20.3,13.8 24.3,13.8 24.3,12.6 20.3,12.6
IN1 on Bottom Layer: 20.3,18.2 24.3,18.2 24.3,15.6 20.3,15.6
IP1 on Top Layer: 20.3,18.1 24.3,18.1 24.3,15.6 20.3,15.6
IP1 on Bottom Layer: 20.3,10.7 24.3,10.7 24.3,9.7 20.3,9.7
LX on Top Layer: 57.75,18.73 67.25,18.73 67.25,15.68 57.75,15.68
LX on Top Layer: 51.7,28.4 57.42,28.4 57.42,21.9 51.7,21.9
LX on Bottom Layer: 57.8,10.7 67.5,10.7 67.5,9.7 57.8,9.7
VN on Bottom Layer: 14.8,13.8 18.8,13.8 18.8,12.6 14.8,12.6
VN on Bottom Layer: 14.8,18.2 18.8,18.2 18.8,15.6 14.8,15.6
VP on Top Layer: 14.8,18.1 18.8,18.1 18.8,15.6 14.8,15.6
VP on Bottom Layer: 14.8,10.7 18.8,10.7 18.8,9.7 14.8,9.7

## Text on the board
Bottom Silkscreen Layer: Firmware / by Tasmota | DEVELOPED BY ROBONOMICS COMMUNITY | CT | ENERGY MONITOR | AC | 230
Top Silkscreen Layer: PWD LED | Current / Transformer | AC 230V | N | L
